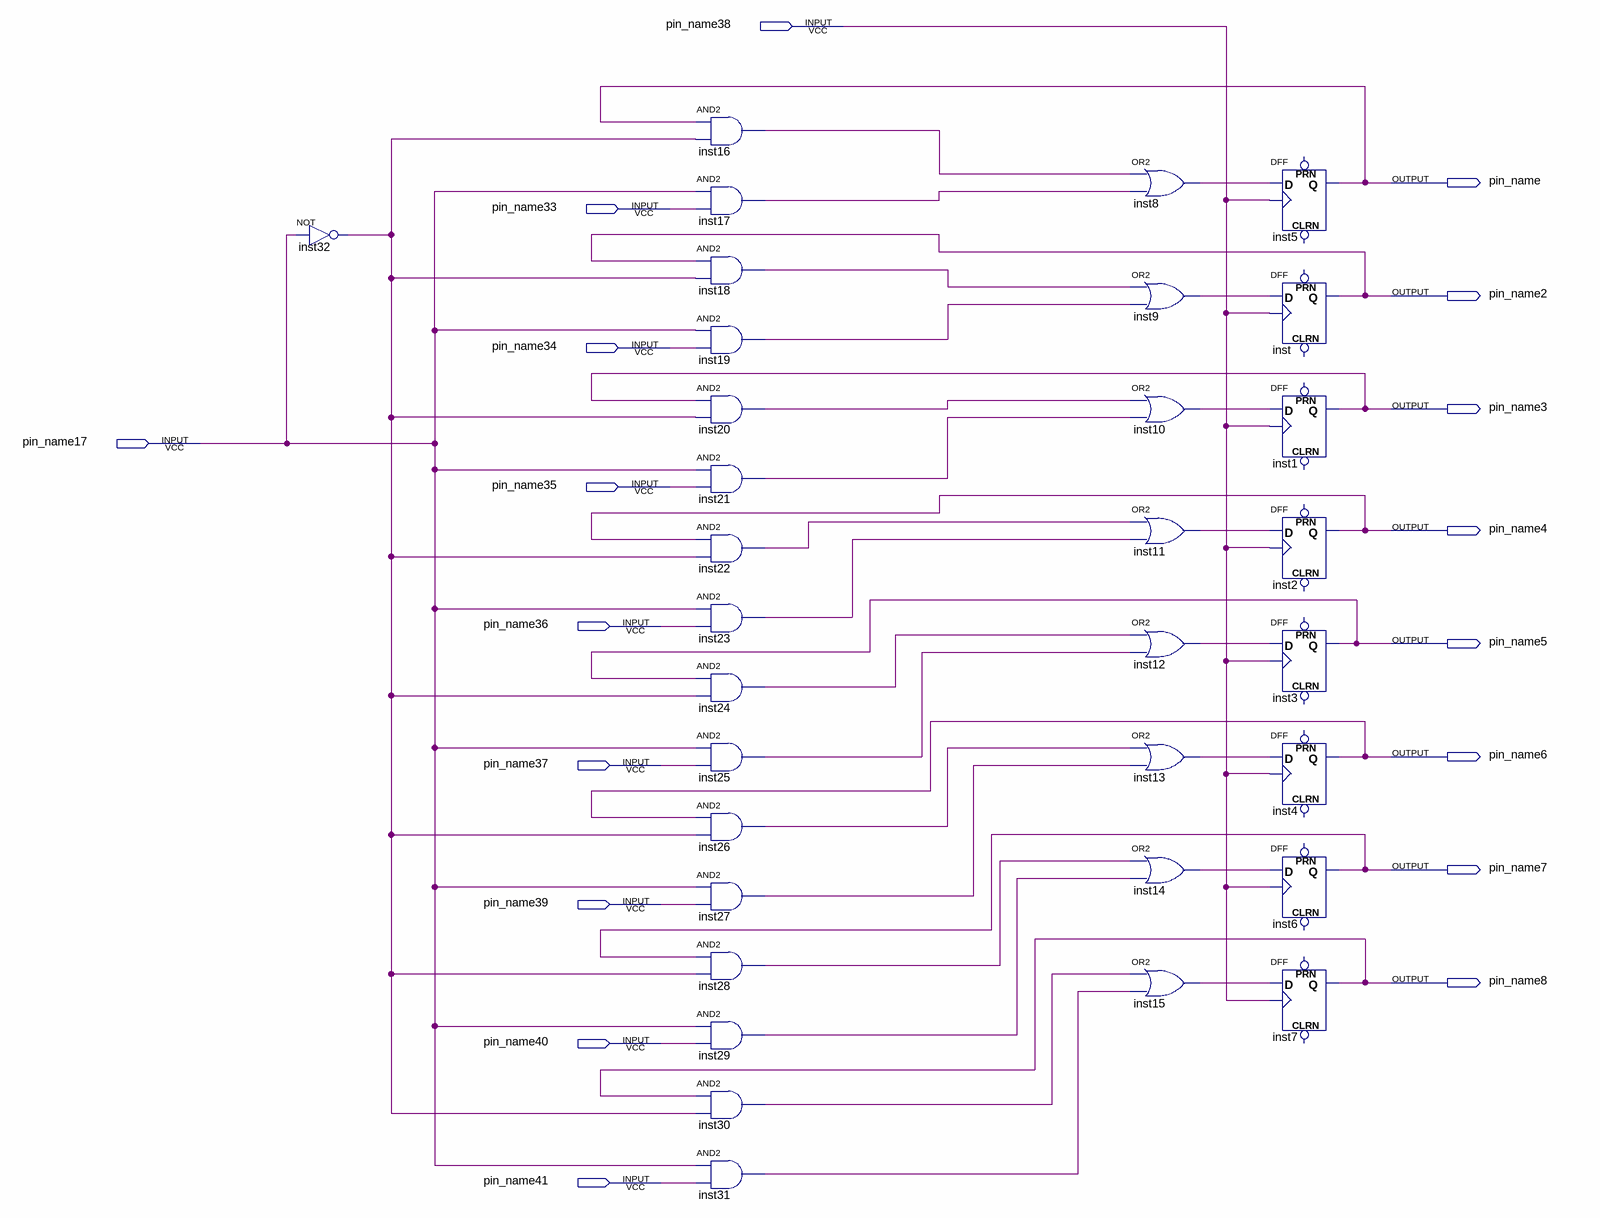
[diagram p0: schematic sheet]
// Quartus schematic reg.bdf as structural Verilog: 33 symbols, 18 pins
module \reg  (
  input  pin_name38,
  input  pin_name33,
  input  pin_name34,
  input  pin_name17,
  input  pin_name35,
  input  pin_name36,
  input  pin_name37,
  input  pin_name39,
  input  pin_name40,
  input  pin_name41,
  output pin_name,
  output pin_name2,
  output pin_name3,
  output pin_name4,
  output pin_name5,
  output pin_name6,
  output pin_name7,
  output pin_name8
);

  wire inst8_out, inst9_out, inst10_out, inst11_out, inst12_out, inst13_out, inst14_out, inst15_out,
       inst16_out, inst17_out, inst18_out, inst19_out, inst20_out, inst21_out, inst22_out, inst23_out,
       inst24_out, inst25_out, inst26_out, inst27_out, inst28_out, inst29_out, inst30_out, inst31_out,
       inst32_out;

  not inst32 (inst32_out, pin_name17);
  and inst16 (inst16_out, pin_name, inst32_out);
  and inst17 (inst17_out, pin_name17, pin_name33);
  and inst18 (inst18_out, pin_name2, inst32_out);
  and inst19 (inst19_out, pin_name17, pin_name34);
  and inst20 (inst20_out, pin_name3, inst32_out);
  and inst21 (inst21_out, pin_name17, pin_name35);
  and inst22 (inst22_out, pin_name4, inst32_out);
  and inst23 (inst23_out, pin_name17, pin_name36);
  and inst24 (inst24_out, pin_name5, inst32_out);
  and inst25 (inst25_out, pin_name17, pin_name37);
  and inst26 (inst26_out, pin_name6, inst32_out);
  and inst27 (inst27_out, pin_name17, pin_name39);
  and inst28 (inst28_out, pin_name7, inst32_out);
  and inst29 (inst29_out, pin_name17, pin_name40);
  and inst30 (inst30_out, pin_name8, inst32_out);
  and inst31 (inst31_out, pin_name17, pin_name41);
  or inst8 (inst8_out, inst16_out, inst17_out);
  or inst9 (inst9_out, inst18_out, inst19_out);
  or inst10 (inst10_out, inst20_out, inst21_out);
  or inst11 (inst11_out, inst22_out, inst23_out);
  or inst12 (inst12_out, inst24_out, inst25_out);
  or inst13 (inst13_out, inst26_out, inst27_out);
  or inst14 (inst14_out, inst28_out, inst29_out);
  or inst15 (inst15_out, inst30_out, inst31_out);
  DFF inst5 (.CLK(pin_name38), .D(inst8_out), .Q(pin_name));  // open: CLRN, PRN
  DFF inst (.CLK(pin_name38), .D(inst9_out), .Q(pin_name2));  // open: CLRN, PRN
  DFF inst1 (.CLK(pin_name38), .D(inst10_out), .Q(pin_name3));  // open: CLRN, PRN
  DFF inst2 (.CLK(pin_name38), .D(inst11_out), .Q(pin_name4));  // open: CLRN, PRN
  DFF inst3 (.CLK(pin_name38), .D(inst12_out), .Q(pin_name5));  // open: CLRN, PRN
  DFF inst4 (.CLK(pin_name38), .D(inst13_out), .Q(pin_name6));  // open: CLRN, PRN
  DFF inst6 (.CLK(pin_name38), .D(inst14_out), .Q(pin_name7));  // open: CLRN, PRN
  DFF inst7 (.CLK(pin_name38), .D(inst15_out), .Q(pin_name8));  // open: CLRN, PRN
endmodule
